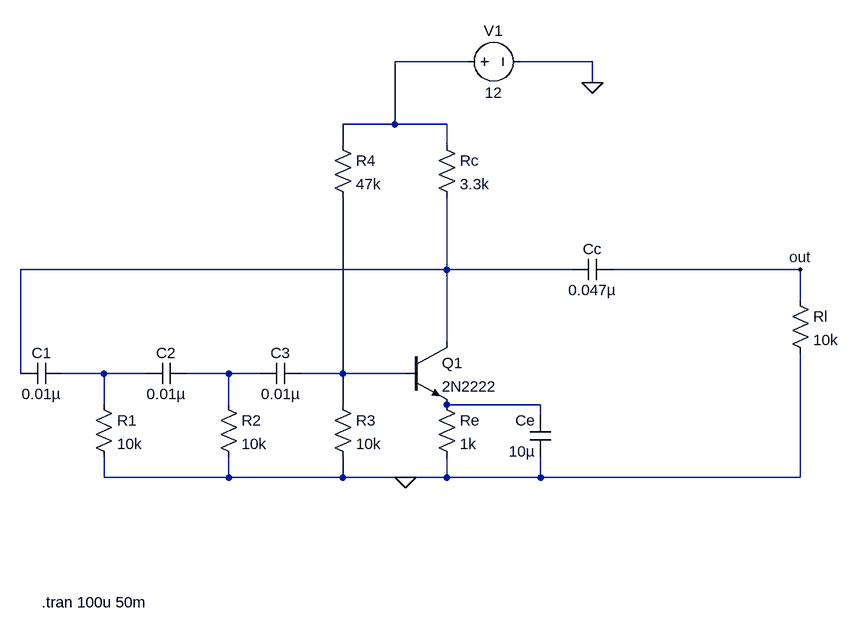
[diagram p0: schematic RC Phase Shift Oscillator.asc]
RC Phase Shift Oscillator.asc, the LTspice schematic file:
Version 4
SHEET 1 880 680
WIRE 144 -288 32 -288
WIRE 336 -288 224 -288
WIRE 336 -256 336 -288
WIRE 32 -192 32 -288
WIRE 32 -192 -48 -192
WIRE 112 -192 32 -192
WIRE -48 -160 -48 -192
WIRE 112 -160 112 -192
WIRE 112 32 112 -80
WIRE 112 32 -544 32
WIRE 304 32 112 32
WIRE 656 32 368 32
WIRE 656 80 656 32
WIRE 112 144 112 32
WIRE -544 192 -544 32
WIRE -416 192 -480 192
WIRE -352 192 -416 192
WIRE -224 192 -288 192
WIRE -176 192 -224 192
WIRE -48 192 -48 -80
WIRE -48 192 -112 192
WIRE 48 192 -48 192
WIRE -416 240 -416 192
WIRE -224 240 -224 192
WIRE -48 240 -48 192
WIRE 256 240 112 240
WIRE 256 256 256 240
WIRE -416 352 -416 320
WIRE -224 352 -224 320
WIRE -224 352 -416 352
WIRE -48 352 -48 320
WIRE -48 352 -224 352
WIRE 48 352 -48 352
WIRE 112 352 112 320
WIRE 112 352 48 352
WIRE 256 352 256 320
WIRE 256 352 112 352
WIRE 656 352 656 160
WIRE 656 352 256 352
FLAG 336 -256 0
FLAG 48 352 0
FLAG 656 32 out
SYMBOL cap -480 176 R90
WINDOW 0 0 32 VBottom 2
WINDOW 3 32 32 VTop 2
SYMATTR InstName C1
SYMATTR Value 0.01µ
SYMBOL cap -288 176 R90
WINDOW 0 0 32 VBottom 2
WINDOW 3 32 32 VTop 2
SYMATTR InstName C2
SYMATTR Value 0.01µ
SYMBOL cap -112 176 R90
WINDOW 0 0 32 VBottom 2
WINDOW 3 32 32 VTop 2
SYMATTR InstName C3
SYMATTR Value 0.01µ
SYMBOL res -432 224 R0
SYMATTR InstName R1
SYMATTR Value 10k
SYMBOL res -240 224 R0
SYMATTR InstName R2
SYMATTR Value 10k
SYMBOL res -64 224 R0
SYMATTR InstName R3
SYMATTR Value 10k
SYMBOL res -64 -176 R0
SYMATTR InstName R4
SYMATTR Value 47k
SYMBOL res 96 -176 R0
SYMATTR InstName Rc
SYMATTR Value 3.3k
SYMBOL res 96 224 R0
SYMATTR InstName Re
SYMATTR Value 1k
SYMBOL npn 48 144 R0
SYMATTR InstName Q1
SYMATTR Value 2N2222
SYMBOL cap 368 16 R90
WINDOW 0 0 32 VBottom 2
WINDOW 3 32 32 VTop 2
SYMATTR InstName Cc
SYMATTR Value 0.047µ
SYMBOL cap 272 320 R180
WINDOW 0 24 56 Left 2
WINDOW 3 24 8 Left 2
SYMATTR InstName Ce
SYMATTR Value 10µ
SYMBOL res 640 64 R0
SYMATTR InstName Rl
SYMATTR Value 10k
SYMBOL voltage 128 -288 R270
WINDOW 0 32 56 VTop 2
WINDOW 3 -32 56 VBottom 2
WINDOW 123 0 0 Left 0
WINDOW 39 0 0 Left 0
SYMATTR InstName V1
SYMATTR Value 12
TEXT -512 544 Left 2 !.tran 100u 50m

The netlist it stands for:
* RC Phase Shift Oscillator.asc
C1 N003 N002 0.01µ
C2 N004 N003 0.01µ
C3 N005 N004 0.01µ
R1 N003 0 10k
R2 N004 0 10k
R3 N005 0 10k
R4 N001 N005 47k
Rc N001 N002 3.3k
Re N006 0 1k
Q1 N002 N005 N006 0 2N2222
Cc out N002 0.047µ
Ce 0 N006 10µ
Rl out 0 10k
V1 N001 0 12
.model NPN NPN
.model PNP PNP
.lib standard.bjt
.tran 100u 50m
.backanno
.end